# Altium schematic sheet LPCB218 - LIFT MECH RELAYS.SchDoc
size A3; Address1: Factory 10; Address2: 9-13 Dingley Avenue, Dandeong, VICTORIA 3175, AUSTRALIA; DocumentNumber: 10; Revision: 1; SheetNumber: 10; SheetTotal: 14; Lockie__PCB_SUB_ASSEMBLY: Lift Mech; Lockie__PCB_ASSEMBLY: Command Node; Lockie__LDL: LPCB218; Lockie__PCB_DESCRIPTION: Command Node
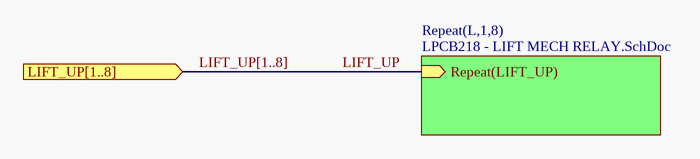
[diagram p0: LPCB218 - LIFT MECH RELAYS.SchDoc]

## Sub-sheets
Repeat(L,1,8) = LPCB218 - LIFT MECH RELAY.SchDoc: Repeat(LIFT_UP) (in)

## Ports
LIFT_UP[1..8] (in)

## Nets
LIFT_UP: sheet Repeat(L,1,8)/Repeat(LIFT_UP)

## Buses and harness runs
bus LIFT_UP[1..8] = port LIFT_UP[1..8]

## Notes on the sheet
- PCB COMPONENT DESCRIPTION
- LDL NUMBER
- Assembly Details
- Size
- Drawing File Name
- Revision
- http://rloop.org
- Scale
- A3
- Sheet Details
- N.T.S
- Sheet:
- Of: